# EAGLE design pic32schem0 (EAGLE 7.5.0)
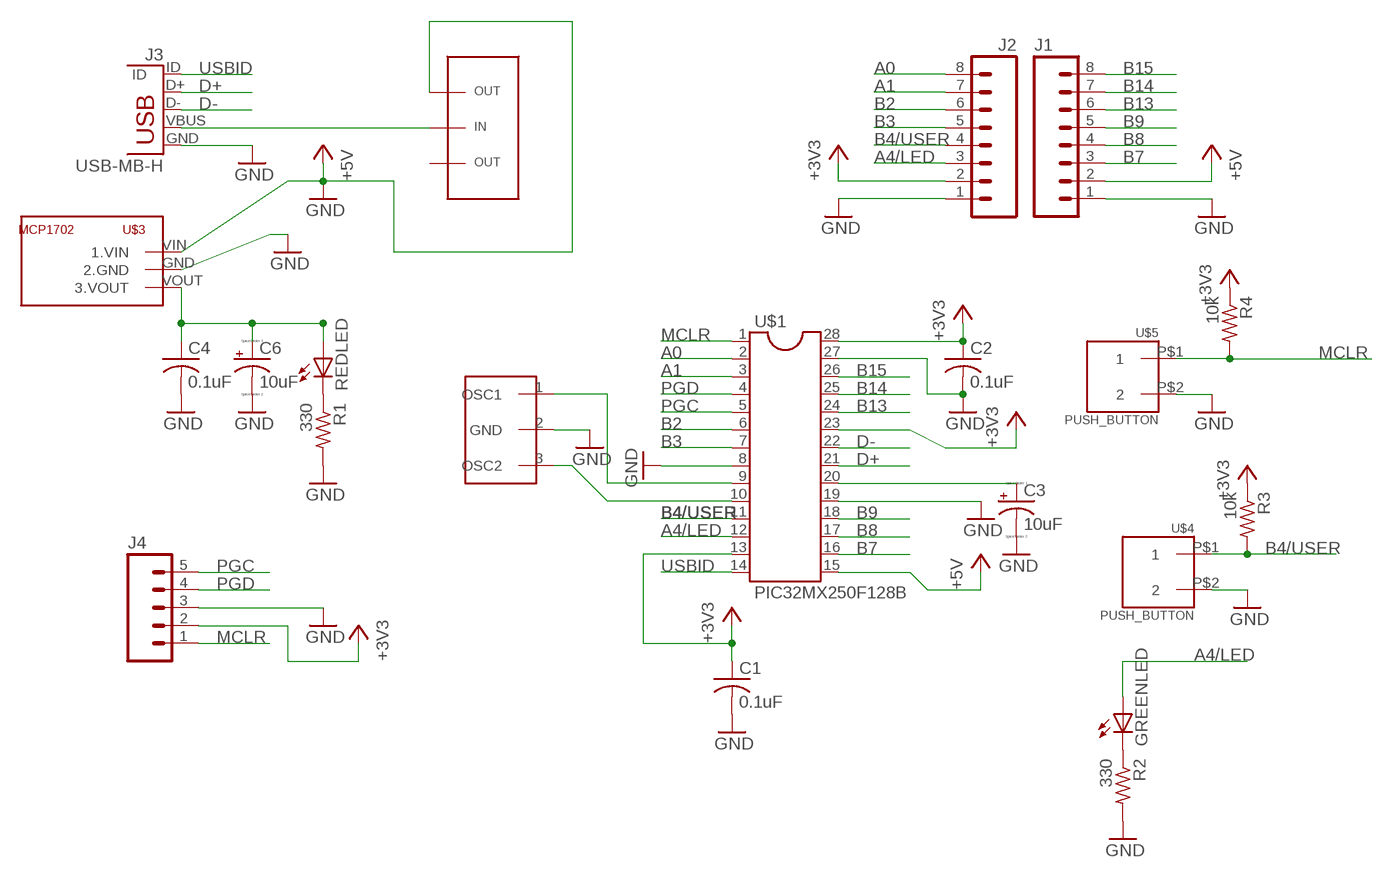
[diagram p0: schematic, sheet 1]

## Parts
C1  0.1uF  C-US025-025X050  [C025-025X050]
C2  0.1uF  C-US025-025X050  [C025-025X050]
C3  10uF  CPOL-USB45181A  [B45181A]
C4  0.1uF  C-US025-025X050  [C025-025X050]
C6  10uF  CPOL-USB45181A  [B45181A]
GREENLED  LED3MM  [LED3MM]
J1  M08  [1X08_ROUND]
J2  M08  [1X08_ROUND]
J3  USB-MB-H  [USB-MB-H]
J4  M05PTH  [1X05]
R1  330  R-US_0207/10  [0207/10]
R2  330  R-US_0207/10  [0207/10]
R3  10k  R-US_0207/10  [0207/10]
R4  10k  R-US_0207/10  [0207/10]
REDLED  LED3MM  [LED3MM]
U$1  PIC32MX250F128B  [DIL28-3]
U$2  SLIDE_SWITCH  [SLIDE_SWITCH]
U$3  MCP1702  [TO92]
U$4  PUSH_BUTTON  [PUSH_BUTTON]
U$5  PUSH_BUTTON  [PUSH_BUTTON]
Y1  RESONATOR  [RESONATOR-PTH]

## Nets
+3V3: C1.1 C2.1 J2.2 J4.2 R3.1 R4.1 U$1.23(23.VUSB3V3) U$1.28(28.AVDD)
+5V: J1.2 U$1.15(15.VBUS)
A0: J2.8 U$1.2(2.PGED3/VREF+/CVREF+/AN0/C3INC/RPA0/CTED1/PMD7/RA0)
A1: J2.7 U$1.3(3.PGED3/VREF-/CVREF-/AN1/RPA1/CTED2/PMD6/RA1)
A4/LED: GREENLED.A J2.3 U$1.12(12.SOSCO/RPA4/T1CK/CTED9/PMA1/RA4)
B2: J2.6 U$1.6(6.AN4/C1INB/C2IND/RPB2/SDA2/CTED13/PMD2/RB2)
B3: J2.5 U$1.7(7.AN5/C1INA/C2INC/RTCC/RPB3/SCL2/PMWR/RB3)
B4/USER: J2.4 R3.2 U$1.11(11.SOSCI/RPB4/RB4) U$4.P$1
B7: J1.3 U$1.16(16.TDI/RPB7/CTED3/PMD5/INT0/RB7)
B8: J1.4 U$1.17(17.TCK/RPB7/CTED10/PMD4/RB8)
B9: J1.5 U$1.18(18.TDO/RPB9/SDA1/CTED4/PMD3/RB9)
B13: J1.6 U$1.24(24.AN11/RPB13/CTPLS/PMRD/RB13)
B14: J1.7 U$1.25(25.CVREFOUT/AN10/C3INB/RPB14/VBUSON/SCK1/CTED5/RB14)
B15: J1.8 U$1.26(26.AN9/C3INA/RPB15/SCK2/CTED6/PMCS1/RB15)
D+: J3.D+ U$1.21(21.PGED2/RPB10/D+/CTED11/RB10)
D-: J3.D- U$1.22(22.PGEC2/RPB11/D-/RB11)
GND: C1.2 C2.2 C3.- C4.2 C6.- J1.1 J2.1 J3.GND J4.3 R1.2 R2.2 U$1.8(8.VSS) U$1.19(19.VSS) U$1.27(27.AVSS) U$2.4.OUT(3.OUT) U$3.GND(2.GND) U$3.VIN(1.VIN) U$4.P$2 U$5.P$2 Y1.2(GND) ; supply symbol labelled +5V
MCLR: J4.1 R4.2 U$1.1(1.MCLR_BAR) U$5.P$1
N$1: U$1.10(10.OSC2/CLKO/RPA3/PMA0/RA3) Y1.3(OSC2)
N$2: U$1.9(9.OSC1/SLKI/RPA2/RA2) Y1.1(OSC1)
N$3: R1.1 REDLED.K(C)
N$4: U$1.13(13.VDD)
N$5: J3.VBUS U$2.3.IN(2.IN)
N$6: C4.1 C6.+ REDLED.A U$3.VOUT(3.VOUT)
N$8: GREENLED.K(C) R2.1
N$9: C3.+ U$1.20(20.VCAP)
PGC: J4.5 U$1.5(5.PGEC1/AN3/C1INC/C2INA/RPB1/CTED12/PMD1/RB1)
PGD: J4.4 U$1.4(4.PGED1/AN2/C1IND/C2INB/C3IND/RPB0/PMD0/RB0)
USBID: J3.ID U$1.14(14.TMS/RPB5/USBID/RB5)
Unconnected: U$2.2.OUT(1.OUT)

## Library data of the parts
C1 C2 C4 = MechE_433:C-US: CAPACITOR, American symbol
C3 C6 = MechE_433:CPOL-US: POLARIZED CAPACITOR, American symbol
GREENLED REDLED = MechE_433:LED: LED OSRAM: - CHIPLED LG R971, LG N971, LY N971, LG Q971, LY Q971, LO R971, LY R971 LH N974, LH R974 LS Q976, LO Q976, LY Q976 LO Q996 - Hyper CHIPLED LW Q18S LB Q993, LB Q99A, LB R99A - SideLED LS A670, LO A670, LY A670, LG A670, LP A670 LB A673, LV A673, LT A673, LW A673 LH A674 LY A675 LS A676, LA A676, LO A676, LY A676, LW A676 LS A679, LY A679, LG A679 - Hyper Micro SIDELED® LS Y876, LA Y876, LO Y876, LY Y876 LT Y87S - SmartLED LW L88C, LW L88S LB L89C, LB L89S, LG L890 LS L89K, LO L89K, LY L89K LS L896, LA L896, LO L896, LY L896 - TOPLED LS T670, LO T670, LY T670, LG T670, LP T670 LSG T670, LSP T670, LSY T670, LOP T670, LYG T670 LG T671, LOG T671, LSG T671 LB T673, LV T673, LT T673, LW T673 LH T674 LS T676, LA T676, LO T676, LY T676, LB T676, LH T676, LSB T676, LW T676 LB T67C, LV T67C, LT T67C, LS T67K, LO T67K, LY T67K, LW E67C LS E67B, LA E67B, LO E67B, LY E67B, LB E67C, LV E67C, LT E67C LW T67C LS T679, LY T679, LG T679 LS T770, LO T770, LY T770, LG T770, LP T770 LB T773, LV T773, LT T773, LW T773 LH T774 LS E675, LA E675, LY E675, LS T675 LS T776, LA T776, LO T776, LY T776, LB T776 LHGB T686 LT T68C, LB T68C - Hyper Mini TOPLED® LB M676 - Mini TOPLED Santana® LG M470 LS M47K, LO M47K, LY M47K Source: http://www.osram.convergy.de LUXEON: - LUMILED® LXK2-PW12-R00, LXK2-PW12-S00, LXK2-PW14-U00, LXK2-PW14-V00 LXK2-PM12-R00, LXK2-PM12-S00, LXK2-PM14-U00 LXK2-PE12-Q00, LXK2-PE12-R00, LXK2-PE12-S00, LXK2-PE14-T00, LXK2-PE14-U00 LXK2-PB12-K00, LXK2-PB12-L00, LXK2-PB12-M00, LXK2-PB14-N00, LXK2-PB14-P00, LXK2-PB14-Q00 LXK2-PR12-L00, LXK2-PR12-M00, LXK2-PR14-Q00, LXK2-PR14-R00 LXK2-PD12-Q00, LXK2-PD12-R00, LXK2-PD12-S00 LXK2-PH12-R00, LXK2-PH12-S00 LXK2-PL12-P00, LXK2-PL12-Q00, LXK2-PL12-R00 Source: www.luxeon.com KINGBRIGHT: KA-3528ASYC Source: www.kingbright.com
J1 J2 = MechE_433:M08: Header 8 Standard 8-pin 0.1" header. Use with straight break away headers (SKU : PRT-00116), right angle break away headers (PRT-00553), swiss pins (PRT-00743), machine pins (PRT-00117), and female headers (PRT-00115).; PROD_ID: CONN-08437
J3 = MechE_433:USB: USB Connectors USB-B-PTH is fully proven SKU : PRT-00139/CONN-08278 USB-miniB is fully proven SKU : PRT-00587 USB-A-PCB is untested. USB-A-H is throughly reviewed, but untested. Spark Fun Electronics SKU : PRT-00437 USB-B-SMT is throughly reviewed, but untested. Needs silkscreen touching up. USB-A-S has not been used/tested USB-MB-H has not been used/tested USB-MICROB has been used. CONN-09505
J4 = MechE_433:M05: Header 5 Standard 5-pin 0.1" header. Use with straight break away headers (SKU : PRT-00116), right angle break away headers (PRT-00553), swiss pins (PRT-00743), machine pins (PRT-00117), and female headers (PRT-00115). Molex polarized connector foot print use with SKU : PRT-08230 with associated crimp pins and housings.
R1-R4 = MechE_433:R-US_: RESISTOR, American symbol
U$1 = MechE_433:PIC32MX250F128B
U$2 = MechE_433:SLIDE_SWITCH
U$3 = MechE_433:MCP1702
U$4 U$5 = MechE_433:PUSH_BUTTON
Y1 = MechE_433:RESONATOR: Resonator Small SMD resonator. Used, eg, on the Arduino Pro/ Pro Mini boards. 8MHz- XTAL-08895 16MHz- XTAL-08900

## Board
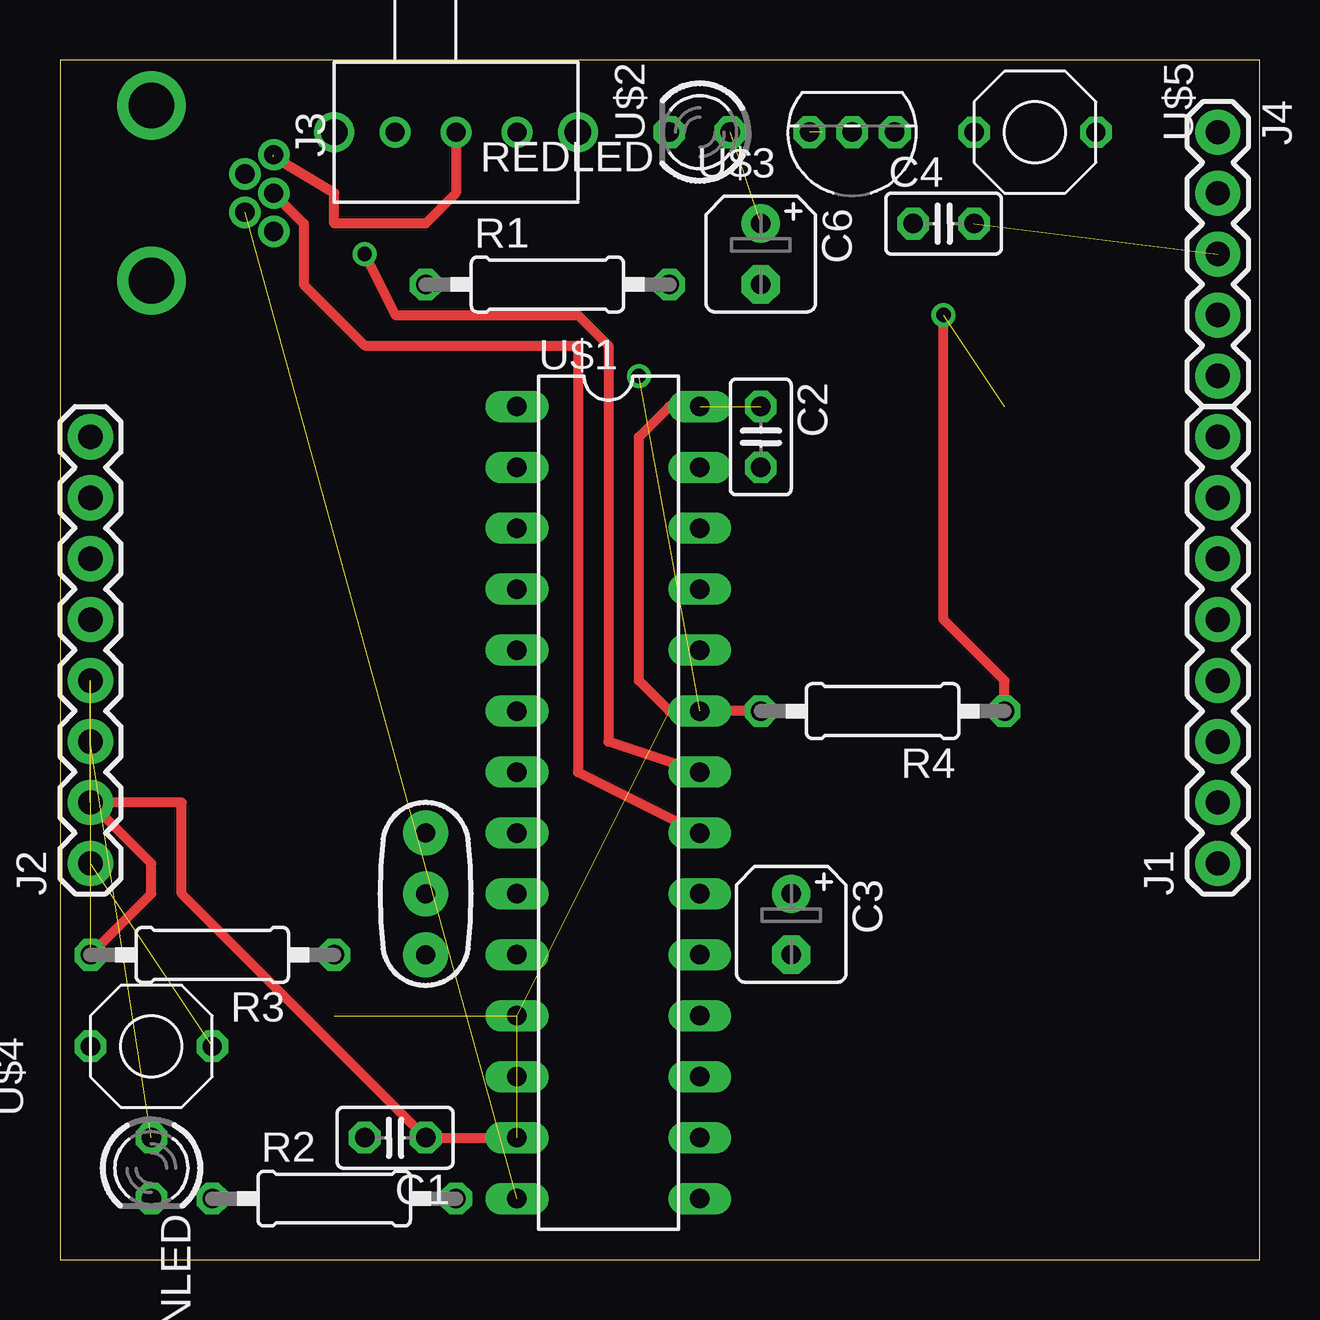
[diagram p1: board, top side]
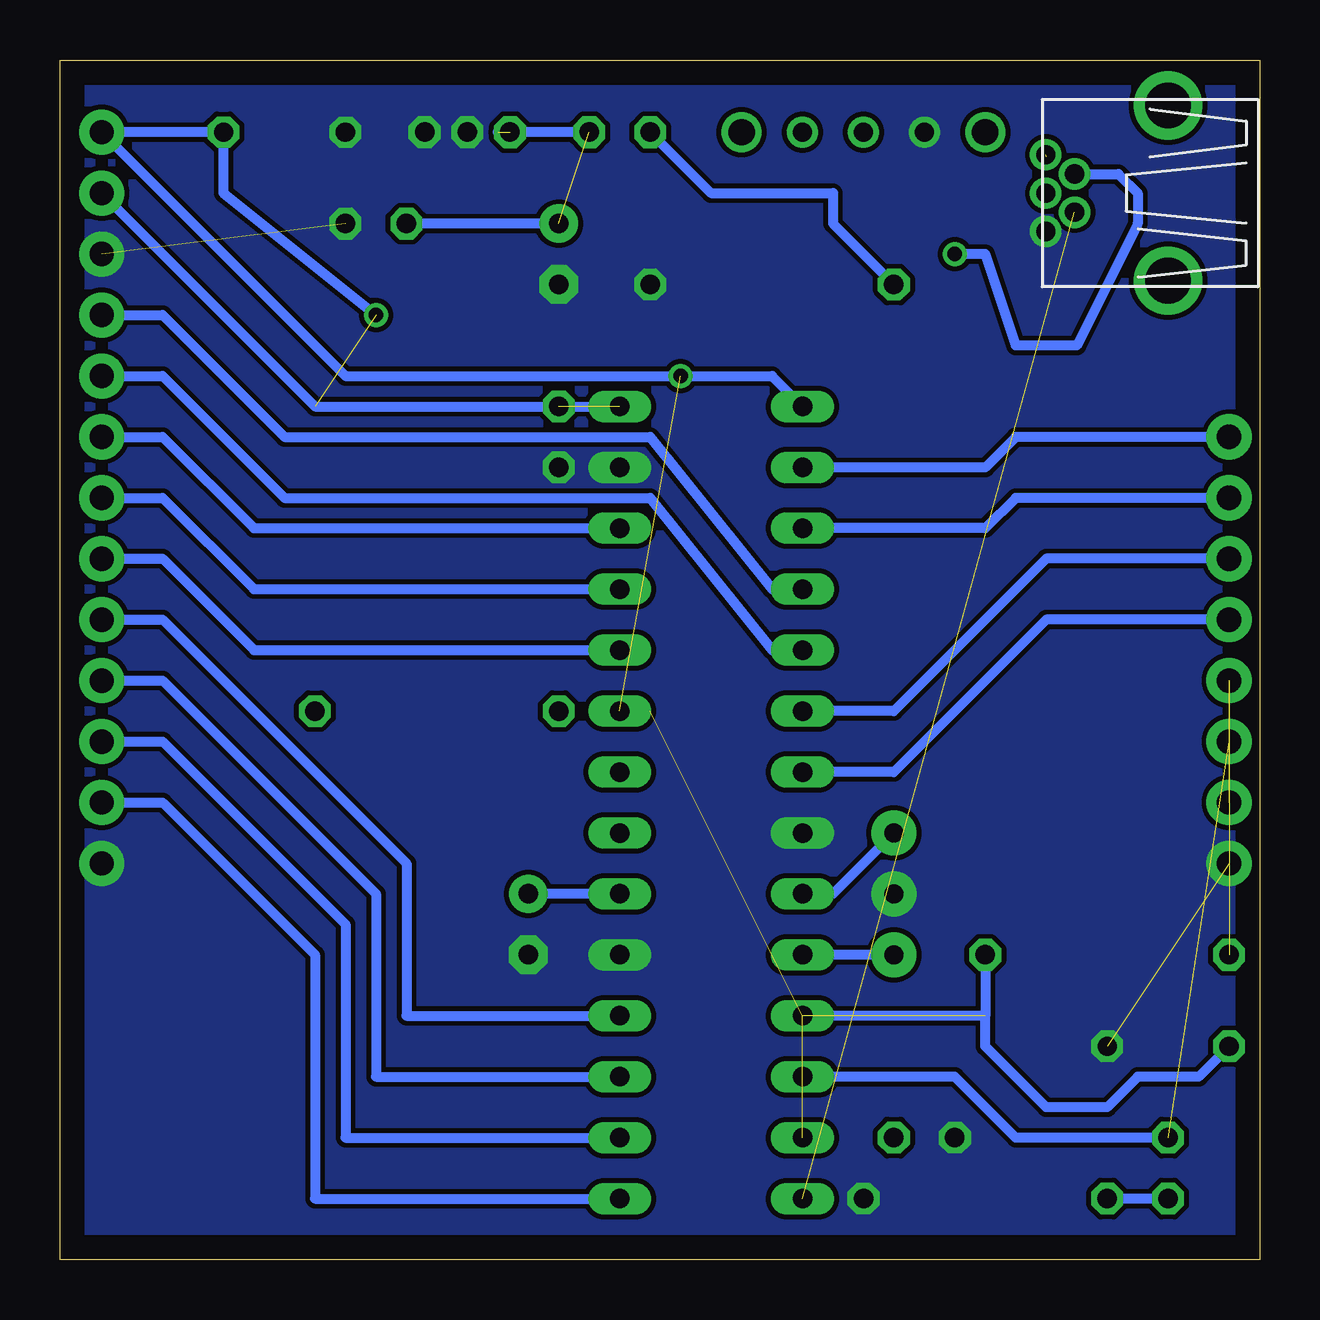
[diagram p2: board, bottom side, seen from below]

Size 50 x 50 mm. Coordinates in mm from the lower left corner, seen from the top.
Outline: 0,0 50,0 50,50 0,50 0,0
Copper layers (1*16): Top 0.035mm / dielectric 1.5mm / Bottom 0.035mm
Design rules "default": minimum track width 10mil, minimum drill 24mil, track to track 8mil, track to pad 8mil, pad to pad 8mil, via to via 8mil, smd to smd 8mil, copper to edge 40mil, drill to drill 8mil, minimum pad ring 10mil, minimum via ring 8mil, stop-mask expansion 4mil, vias tented up to drill 0mil, thermal gap 10mil

### Footprints (pad centres in the part's own frame; a part is rotated, then mirrored left to right if it is on the bottom)
C025-025X050 = drill 0.813 octagon: 1 -1.27,0; 2 1.27,0
B45181A = drill 0.813 pad 1.6: + -1.27,0 | drill 0.813 pad 1.6 octagon: - 1.27,0
LED3MM = drill 0.813 octagon: A -1.27,0; K 1.27,0
1X08_ROUND = drill 1.016 pad 1.88: 1 0,0; 2 2.54,0; 3 5.08,0; 4 7.62,0; 5 10.16,0; 6 12.7,0; 7 15.24,0; 8 17.78,0
USB-MB-H = drill 0.8: D+ 5.1,0; D- 3.9,0.8; GND 5.1,-1.6; ID 3.9,-0.8; VBUS 5.1,1.6 | drill 1.9: P$6 0,-3.65; P$7 0,3.65
1X05 = drill 1.016 pad 1.88: 1 0,0; 2 2.54,0; 3 5.08,0; 4 7.62,0; 5 10.16,0
0207/10 = drill 0.813 octagon: 1 -5.08,0; 2 5.08,0
DIL28-3 = drill 0.813 long: 1 -16.51,-3.81; 2 -13.97,-3.81; 3 -11.43,-3.81; 4 -8.89,-3.81; 5 -6.35,-3.81; 6 -3.81,-3.81; 7 -1.27,-3.81; 8 1.27,-3.81; 9 3.81,-3.81; 10 6.35,-3.81; 11 8.89,-3.81; 12 11.43,-3.81; 13 13.97,-3.81; 14 16.51,-3.81; 15 16.51,3.81; 16 13.97,3.81; 17 11.43,3.81; 18 8.89,3.81; 19 6.35,3.81; 20 3.81,3.81; 21 1.27,3.81; 22 -1.27,3.81; 23 -3.81,3.81; 24 -6.35,3.81; 25 -8.89,3.81; 26 -11.43,3.81; 27 -13.97,3.81; 28 -16.51,3.81; 29 -6.35,3.81
SLIDE_SWITCH = drill 1.1 pad 1.676: 1 -5.08,0; 5. 5.08,0 | drill 0.8 pad 1.27: 2.OUT -2.54,0; 3.IN 0,0; 4.OUT 2.54,0
TO92 = drill 0.813 octagon: GND -1.778,0; VIN 0,0; VOUT 1.778,0
PUSH_BUTTON = drill 0.8 octagon: P$1 -5.08,0; P$2 0,0
RESONATOR-PTH = drill 0.8 pad 1.88: 1 -2.54,0; 2 0,0; 3 2.54,0

### Placement (x,y rotation side)
C1  13.97,5.08 180 top
C2  29.21,34.29 270 top
C3  30.48,13.97 270 top
C4  36.83,43.18 0 top
C6  29.21,41.91 270 top
GREENLED  3.81,3.81 270 top
J1  48.26,16.51 90 top
J2  1.27,16.51 90 top
J3  3.81,44.45 0 top
J4  48.26,46.99 270 top
R1  20.32,40.64 0 top
R2  11.43,2.54 0 top
R3  6.35,12.7 180 top
R4  34.29,22.86 180 top
REDLED  26.67,46.99 180 top
U$1  22.86,19.05 270 top
U$2  16.51,46.99 180 top
U$3  33.02,46.99 180 top
U$4  6.35,8.89 0 top
U$5  38.1,46.99 180 top
Y1  15.24,15.24 270 top

### Tracks (layer width: path | path; a pad name or v marks a point on that pad's centre or on a via)
+3V3  (via drill 0.6)  (4 unrouted)
  Top 0.406: J2.2 5.08,19.05 5.08,15.24 C1.1 19.05,5.08 | U$1.23 25.4,22.86 24.13,24.13 24.13,34.29 25.4,35.56 U$1.28 | R4.1 39.37,24.13 36.83,26.67 v36.83,39.37
  Bottom 0.406: J4.2 39.37,35.56 U$1.28 | 43.18,46.99 43.18,44.45 v36.83,39.37 | R3.1 11.43,10.16 19.05,10.16
+5V
  Bottom 0.406: J1.2 45.72,19.05 39.37,12.7 39.37,2.54 U$1.15
A0
  Bottom 0.406: J2.8 10.16,34.29 11.43,33.02 U$1.2
A1
  Bottom 0.406: J2.7 10.16,31.75 11.43,30.48 U$1.3
A4/LED  (1 unrouted)
  Bottom 0.406: GREENLED.A 10.16,5.08 12.7,7.62 U$1.12
B2
  Bottom 0.406: J2.6 8.89,29.21 15.24,22.86 U$1.6
B3
  Bottom 0.406: J2.5 8.89,26.67 15.24,20.32 U$1.7
B4/USER  (3 unrouted)
  Top 0.406: R3.2 3.81,15.24 3.81,16.51 1.27,19.05
  Bottom 0.406: U$4.P$1 2.54,7.62 5.08,7.62 6.35,6.35 8.89,6.35 11.43,8.89 11.43,10.16
B7
  Bottom 0.406: J1.3 45.72,21.59 38.1,13.97 38.1,5.08 U$1.16
B8
  Bottom 0.406: J1.4 45.72,24.13 36.83,15.24 36.83,7.62 U$1.17
B9
  Bottom 0.406: J1.5 45.72,26.67 35.56,16.51 35.56,10.16 U$1.18
B13
  Bottom 0.406: J1.6 45.72,29.21 41.91,25.4 U$1.24
B14
  Bottom 0.406: J1.7 45.72,31.75 41.91,27.94 U$1.25
B15
  Bottom 0.406: J1.8 45.72,34.29 41.91,30.48 U$1.26
D+
  Top 0.406: J3.D+ 8.91,44.43 | U$1.21 21.59,20.32 21.59,38.1 12.7,38.1 10.16,40.64 10.16,43.18 8.91,44.43 | 8.91,44.43 8.89,44.45
D-  (via drill 0.6)
  Top 0.406: v12.7,41.91 13.97,39.37 21.59,39.37 22.86,38.1 22.86,21.59 U$1.22
  Bottom 0.406: J3.D- 5.88,45.25 5.08,44.45 5.08,43.18 7.62,38.1 10.16,38.1 11.43,41.91 v12.7,41.91
GND  (2 unrouted)
  pour Bottom (no thermals): 0,0 50,0 50,50 0,50
MCLR  (via drill 0.6)  (1 unrouted)
  Top 0.406: R4.2 26.67,22.86
  Bottom 0.406: U$5.P$1 J4.1 38.1,36.83 v24.13,36.83 20.32,36.83 U$1.1
N$1
  Bottom 0.406: Y1.3 U$1.10
N$2
  Bottom 0.406: Y1.1 17.78,15.24 U$1.9
N$3
  Bottom 0.406: REDLED.K 22.86,44.45 17.78,44.45 17.78,43.18 R1.1
N$5  (1 unrouted)
  Top 0.406: U$2.3.IN 16.51,44.45 15.24,43.18 11.43,43.18 11.43,44.45 8.89,45.97
N$6  (2 unrouted)
  Bottom 0.406: REDLED.A 31.75,46.99 | C6.+ C4.1
N$8
  Bottom 0.406: GREENLED.K R2.1
N$9
  Bottom 0.406: U$1.20 C3.+
PGC
  Bottom 0.406: J4.5 45.72,36.83 40.64,31.75 25.4,31.75 20.32,25.4 U$1.5
PGD
  Bottom 0.406: J4.4 45.72,39.37 40.64,34.29 25.4,34.29 20.32,27.94 U$1.4
USBID  (1 unrouted)